# EAGLE design PanBoard (EAGLE 7.2.0)
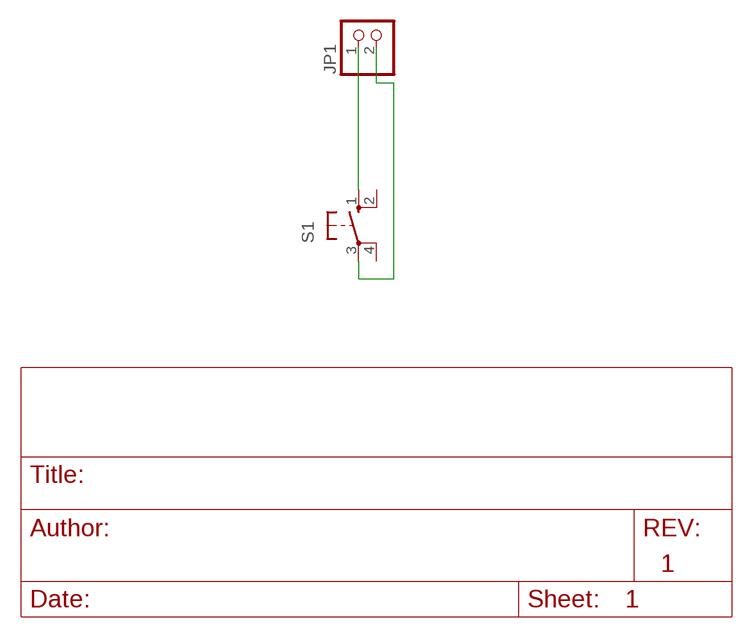
[diagram p0: schematic, sheet 1]
FRAME1 (DINA4_P): AUTHOR: Christoph Ulbinger, BSc; TITLE: Panning Board

## Parts
JP1  PINHD-1X2  [1X02]
S1  10-XX  [B3F-10XX]

## Nets
N$1: JP1.1 S1.1(S)
N$2: JP1.2 S1.3(P)
Unconnected: S1.2(S1) S1.4(P1)

## Library data of the parts
JP1 = pinhead:PINHD-1X2: PIN HEADER
S1 = switch-omron:10-XX: OMRON SWITCH; MPN: B3F-1000; OC_FARNELL: 176432; OC_NEWARK: 36M3542

## Board
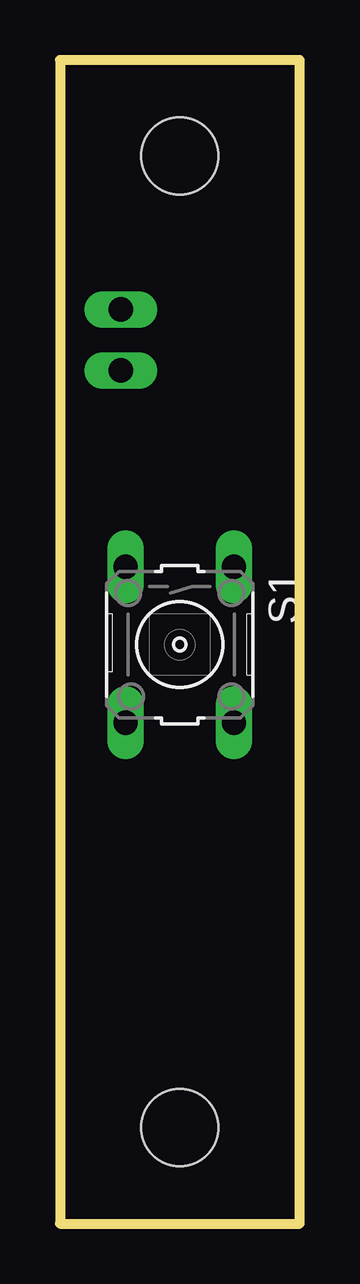
[diagram p1: board, top side]
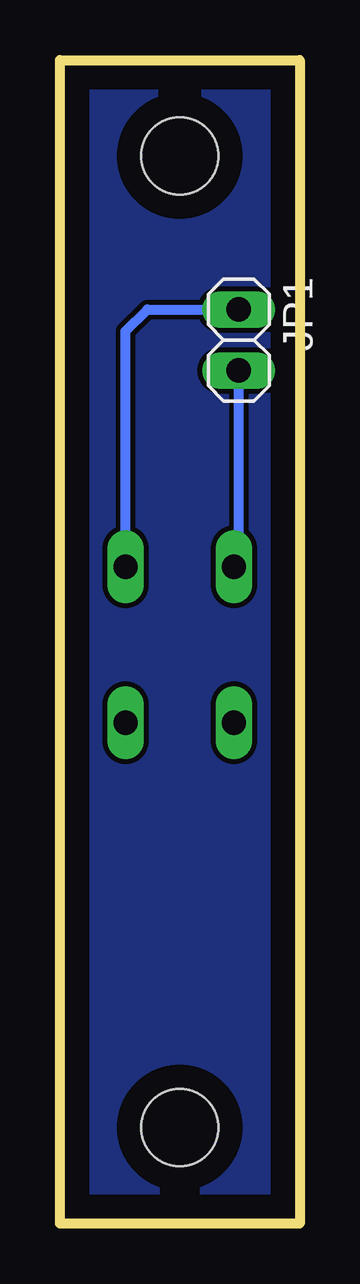
[diagram p2: board, bottom side, seen from below]

Size 10 x 48.5 mm. Coordinates in mm from the lower left corner, seen from the top.
Outline: 0,48.5 0,0 10,0 10,48.5 0,48.5
Copper layers (1*16): Top 0.035mm / dielectric 1.5mm / Bottom 0.035mm
Design rules "default": minimum track width 10mil, minimum drill 24mil, track to track 8mil, track to pad 8mil, pad to pad 8mil, via to via 8mil, smd to smd 8mil, copper to edge 40mil, drill to drill 8mil, minimum pad ring 10mil, minimum via ring 8mil, stop-mask expansion 4mil, vias tented up to drill 0mil, thermal gap 10mil
Holes 3.2 mm at 5,44.5 5,4

### Footprints (pad centres in the part's own frame; a part is rotated, then mirrored left to right if it is on the bottom)
1X02 = drill 1.016 long: 1 -1.27,0; 2 1.27,0
B3F-10XX = drill 1.016 long: 1 -3.251,2.261; 2 3.251,2.261; 3 -3.251,-2.261; 4 3.251,-2.261

### Placement (x,y rotation side)
JP1  2.54,36.83 270 bottom
S1  5,24.13 270 top

### Tracks (layer width: path | path; a pad name or v marks a point on that pad's centre or on a via)
N$1
  Bottom 0.406: S1.1 7.26,37.19 6.35,38.1 JP1.1
N$2
  Bottom 0.406: S1.3 2.54,27.38 JP1.2
N$3
  pour Bottom: 1.27,1.27 1.27,47.23 8.73,47.23 8.73,1.27